# EAGLE schematic EuroKastle_PCB_SCHEM (EAGLE 9.0.0)
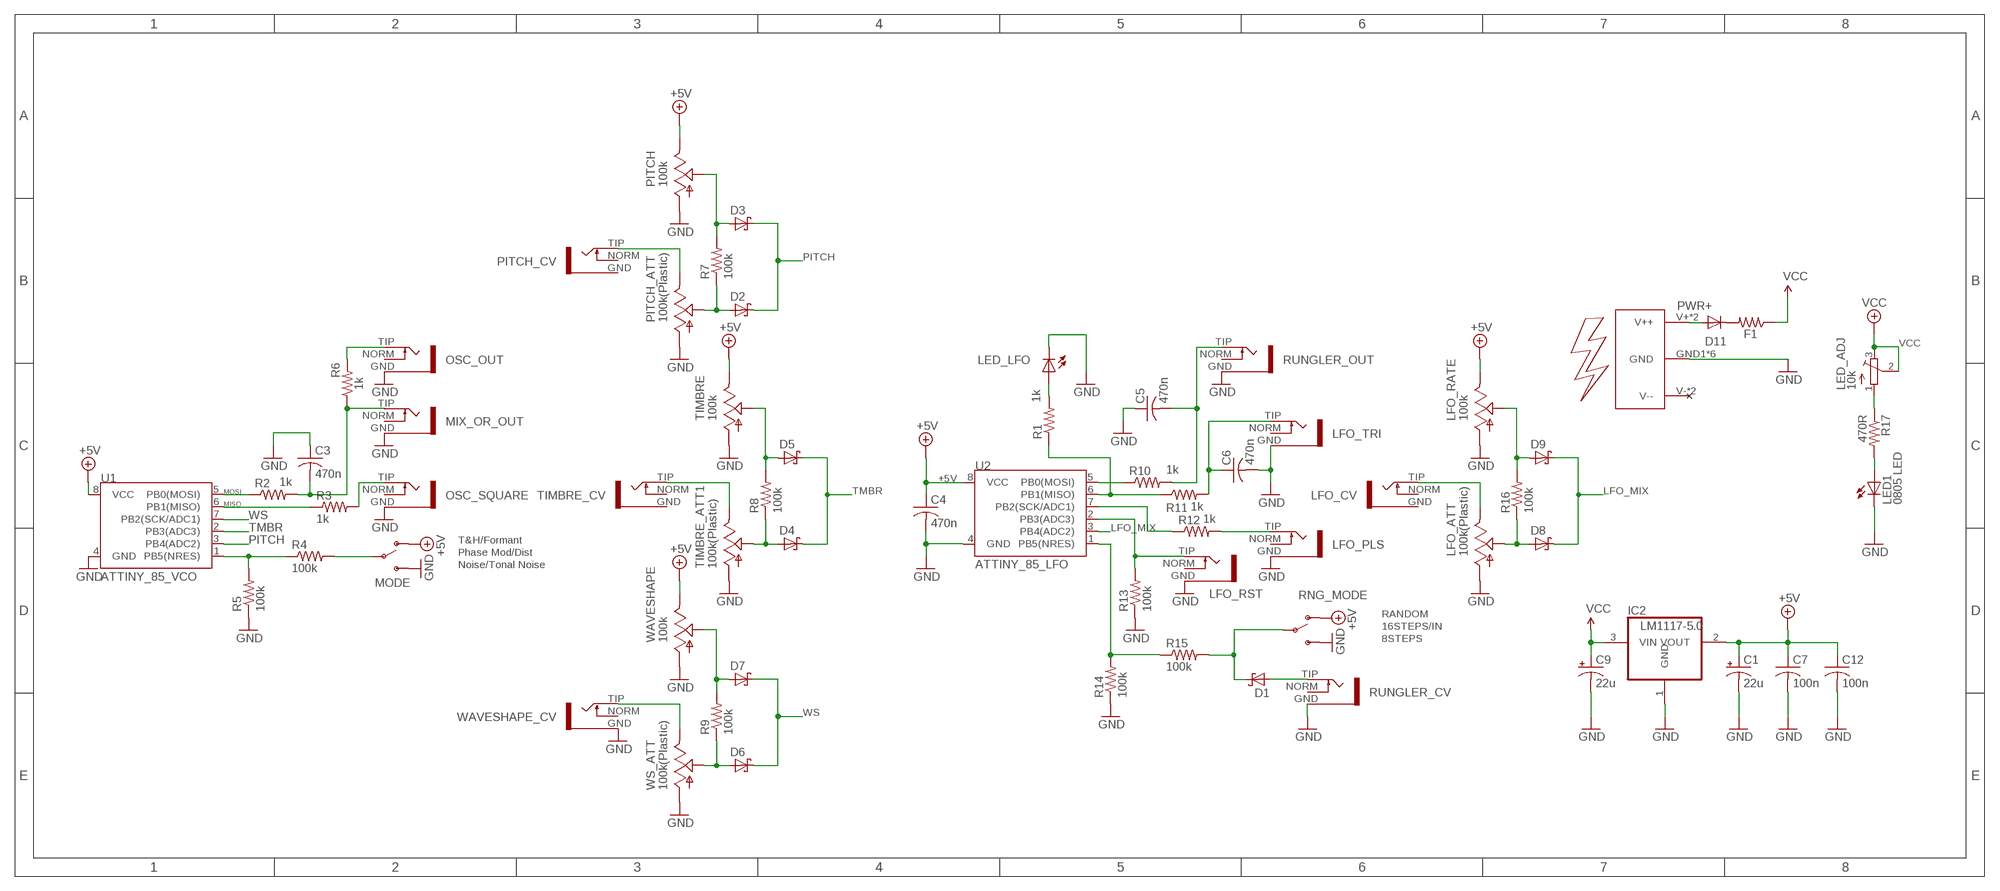
[diagram p0: schematic, sheet 1]

## Parts
C1  22u  CPOL-USE2.5-6  [E2,5-6]
C3  470n  C-USC0603  [C0603]
C4  470n  C-USC0603  [C0603]
C5  470n  C-USC0603  [C0603]
C6  470n  C-USC0603  [C0603]
C7  100n  C-USC0603  [C0603]
C9  22u  CPOL-USE2.5-6  [E2,5-6]
C12  100n  C-USC0603  [C0603]
D1  610-CMDZ5L1  PMEG4005AEA  [SOD323(F)]
D2  610-CMDZ5L1  PMEG4005AEA  [SOD323(F)]
D3  610-CMDZ5L1  PMEG4005AEA  [SOD323(F)]
D4  610-CMDZ5L1  PMEG4005AEA  [SOD323(F)]
D5  610-CMDZ5L1  PMEG4005AEA  [SOD323(F)]
D6  610-CMDZ5L1  PMEG4005AEA  [SOD323(F)]
D7  610-CMDZ5L1  PMEG4005AEA  [SOD323(F)]
D8  610-CMDZ5L1  PMEG4005AEA  [SOD323(F)]
D9  610-CMDZ5L1  PMEG4005AEA  [SOD323(F)]
D11  1N5819HW  DIODE-SOD123  [SOD123]
F1  100Ohms  R-US_R0603  [R0603]
IC2  LM1117-5.0  REG1117  [SOT223]
LED1  0805 LED  LEDCHIP-LED0805  [CHIP-LED0805]
LED_ADJ  10k  TRIMPOTTC33X  [TC33X]
LED_LFO  LED3MM  [LED3MM]
LFO_ATT  100k(Plastic)  9MM_SNAP-IN_POT_  [9MM_SNAP-IN_POT]
LFO_CV  INSTRUO_S_JACK_SMALL2  [INSTRUO_S_JACK_SMALL2]
LFO_PLS  INSTRUO_S_JACK_SMALL2  [INSTRUO_S_JACK_SMALL2]
LFO_RATE  100k  9MM_SNAP-IN_POT_  [9MM_SNAP-IN_POT]
LFO_RST  INSTRUO_S_JACK_SMALL2  [INSTRUO_S_JACK_SMALL2]
LFO_TRI  INSTRUO_S_JACK_SMALL2  [INSTRUO_S_JACK_SMALL2]
MIX_OR_OUT  INSTRUO_S_JACK_SMALL2  [INSTRUO_S_JACK_SMALL2]
MODE  SPDT_ON_OFF_ON_SUBMINI  SUBMINI_SPDT  [SUBMINI_TOGGLE]
OSC_OUT  INSTRUO_S_JACK_SMALL2  [INSTRUO_S_JACK_SMALL2]
OSC_SQUARE  INSTRUO_S_JACK_SMALL2  [INSTRUO_S_JACK_SMALL2]
PITCH  100k  9MM_SNAP-IN_POT_  [9MM_SNAP-IN_POT]
PITCH_ATT  100k(Plastic)  9MM_SNAP-IN_POT_  [9MM_SNAP-IN_POT]
PITCH_CV  INSTRUO_S_JACK_SMALL2  [INSTRUO_S_JACK_SMALL2]
POWER  EURO_POWER2  [EURO_POWER2]
R1  1k  R-US_R0603  [R0603]
R2  1k  R-US_R0603  [R0603]
R3  1k  R-US_R0603  [R0603]
R4  100k  R-US_R0603  [R0603]
R5  100k  R-US_R0603  [R0603]
R6  1k  R-US_R0603  [R0603]
R7  100k  R-US_R0603  [R0603]
R8  100k  R-US_R0603  [R0603]
R9  100k  R-US_R0603  [R0603]
R10  1k  R-US_R0603  [R0603]
R11  1k  R-US_R0603  [R0603]
R12  1k  R-US_R0603  [R0603]
R13  100k  R-US_R0603  [R0603]
R14  100k  R-US_R0603  [R0603]
R15  100k  R-US_R0603  [R0603]
R16  100k  R-US_R0603  [R0603]
R17  470R  R-US_R0603  [R0603]
RNG_MODE  SPDT_ON_OFF_ON_SUBMINI  SUBMINI_SPDT  [SUBMINI_TOGGLE]
RUNGLER_CV  INSTRUO_S_JACK_SMALL2  [INSTRUO_S_JACK_SMALL2]
RUNGLER_OUT  INSTRUO_S_JACK_SMALL2  [INSTRUO_S_JACK_SMALL2]
TIMBRE  100k  9MM_SNAP-IN_POT_  [9MM_SNAP-IN_POT]
TIMBRE_ATT1  100k(Plastic)  9MM_SNAP-IN_POT_  [9MM_SNAP-IN_POT]
TIMBRE_CV  INSTRUO_S_JACK_SMALL2  [INSTRUO_S_JACK_SMALL2]
U1  ATTINY_85_VCO  ATTINY45TINY45-20-DIP  [DIP08_MCU]
U2  ATTINY_85_LFO  ATTINY45TINY45-20-DIP  [DIP08_MCU]
WAVESHAPE  100k  9MM_SNAP-IN_POT_  [9MM_SNAP-IN_POT]
WAVESHAPE_CV  INSTRUO_S_JACK_SMALL2  [INSTRUO_S_JACK_SMALL2]
WS_ATT  100k(Plastic)  9MM_SNAP-IN_POT_  [9MM_SNAP-IN_POT]

## Nets
+5V [+5V]: C1.+ C4.1 C7.1 C12.1 IC2.2(VOUT) LFO_RATE.3(E) MODE.1(O) PITCH.3(E) RNG_MODE.1(O) TIMBRE.3(E) U1.8(VCC) U2.8(VCC) WAVESHAPE.3(E)
GND [GND]: C1.- C3.1 C4.2 C5.1 C6.2 C7.2 C9.- C12.2 IC2.1(GND) LED1.C LED_LFO.K(C) LFO_ATT.1(A) LFO_PLS.GND LFO_RATE.1(A) LFO_RST.GND LFO_TRI.GND MIX_OR_OUT.GND MODE.3(S) OSC_OUT.GND OSC_SQUARE.GND PITCH.1(A) PITCH_ATT.1(A) POWER.GND1(GND) POWER.GND2(GND) POWER.GND3(GND) POWER.GND4(GND) POWER.GND5(GND) POWER.GND6(GND) R5.1 R13.1 R14.1 RNG_MODE.3(S) RUNGLER_CV.GND RUNGLER_OUT.GND TIMBRE.1(A) TIMBRE_ATT1.1(A) U1.4(GND) U2.4(GND) WAVESHAPE.1(A) WAVESHAPE_CV.GND WS_ATT.1(A)
LFO_MIX: D8.1(K) D9.1(K) U2.3(PB4(ADC2))
MISO: R3.1 U1.6(PB1(MISO))
MOSI: R2.1 U1.5(PB0(MOSI))
N$1: C3.2 MIX_OR_OUT.TIP R2.2 R6.1
N$2: R4.1 R5.2 U1.1(PB5(NRES))
N$3: OSC_SQUARE.TIP R3.2
N$4: MODE.COM(COMMON) R4.2
N$5: OSC_OUT.TIP R6.2
N$6: PITCH_ATT.3(E) PITCH_CV.TIP
N$7: D2.2(A) PITCH_ATT.2(S) R7.1
N$8: TIMBRE_ATT1.3(E) TIMBRE_CV.TIP
N$9: D3.2(A) PITCH.2(S) R7.2
N$10: D4.2(A) R8.1 TIMBRE_ATT1.2(S)
N$11: D5.2(A) R8.2 TIMBRE.2(S)
N$12: D6.2(A) R9.1 WS_ATT.2(S)
N$13: WAVESHAPE_CV.TIP WS_ATT.3(E)
N$14: D7.2(A) R9.2 WAVESHAPE.2(S)
N$15: R10.1 U2.5(PB0(MOSI))
N$16: C5.2 R10.2 RUNGLER_OUT.TIP
N$17: R1.1 R11.1 U2.6(PB1(MISO))
N$18: C6.1 LFO_TRI.TIP R11.2
N$19: LFO_RST.TIP R13.2 U2.2(PB3(ADC3))
N$20: R12.1 U2.7(PB2(SCK/ADC1))
N$21: LFO_PLS.TIP R12.2
N$22: R14.2 R15.1 U2.1(PB5(NRES))
N$23: LFO_ATT.3(E) LFO_CV.TIP
N$24: D1.2(A) RUNGLER_CV.TIP
N$25: D8.2(A) LFO_ATT.2(S) R16.1
N$26: D9.2(A) LFO_RATE.2(S) R16.2
N$27: D1.1(K) R15.2 RNG_MODE.COM(COMMON)
N$28: LED_LFO.A R1.2
N$29: LED1.A R17.2
N$30: LED_ADJ.1(A) R17.1
N$34 [+12V]: D11.C F1.2
PITCH: D2.1(K) D3.1(K) U1.3(PB4(ADC2))
PWR+ [+12V]: D11.A POWER.V+(V++) POWER.V++
TMBR: D4.1(K) D5.1(K) U1.2(PB3(ADC3))
VCC [+12V]: C9.+ F1.1 IC2.3(VIN) LED_ADJ.2(S) LED_ADJ.3(E)
WS: D6.1(K) D7.1(K) U1.7(PB2(SCK/ADC1))
Unconnected: LFO_CV.GND LFO_CV.NORM LFO_PLS.NORM LFO_RST.NORM LFO_TRI.NORM MIX_OR_OUT.NORM OSC_OUT.NORM OSC_SQUARE.NORM PITCH_CV.GND PITCH_CV.NORM POWER.V-(V--) POWER.V-- RUNGLER_CV.NORM RUNGLER_OUT.NORM TIMBRE_CV.GND TIMBRE_CV.NORM WAVESHAPE_CV.NORM

## Notes on the sheet
- T&H/Formant
- Phase Mod/Dist
- Noise/Tonal Noise
- RANDOM
- 16STEPS/IN
- 8STEPS

## Library data of the parts
C1 C9 = AA_Stobbert:CPOL-US: POLARIZED CAPACITOR, American symbol
C3-C6 = AA_Stobbert:C-US: CAPACITOR, American symbol
C7 C12 = rcl:C-US: CAPACITOR, American symbol
D1-D9 = nxp_60_1_1:PMEG4005: 40 V 0.5 A Very low VF MEGA Schottky barrier rectifier Planar Maximum Efficiency General Application (MEGA) Schottky barrier rectifier with an integrated guard ring for stress protection, encapsulated in a SOD323 (SC-76) very small SMD plastic packag AAL Eindhoven MK
D11 = diode:DIODE-: DIODE
F1 R1-R16 = AA_Stobbert:R-US_: RESISTOR, American symbol
IC2 = og-vreg:REG1117: 800mA and 1A Low Dropout (LDO) Positive Regulator 1.8V, 2.5V, 2.85V, 3.3V, 5V, and Adj
LED1 = adafruit:LED: LED OSRAM: - CHIPLED LG R971, LG N971, LY N971, LG Q971, LY Q971, LO R971, LY R971 LH N974, LH R974 LS Q976, LO Q976, LY Q976 LO Q996 - Hyper CHIPLED LW Q18S LB Q993, LB Q99A, LB R99A - SideLED LS A670, LO A670, LY A670, LG A670, LP A670 LB A673, LV A673, LT A673, LW A673 LH A674 LY A675 LS A676, LA A676, LO A676, LY A676, LW A676 LS A679, LY A679, LG A679 - Hyper Micro SIDELED® LS Y876, LA Y876, LO Y876, LY Y876 LT Y87S - SmartLED LW L88C, LW L88S LB L89C, LB L89S, LG L890 LS L89K, LO L89K, LY L89K LS L896, LA L896, LO L896, LY L896 - TOPLED LS T670, LO T670, LY T670, LG T670, LP T670 LSG T670, LSP T670, LSY T670, LOP T670, LYG T670 LG T671, LOG T671, LSG T671 LB T673, LV T673, LT T673, LW T673 LH T674 LS T676, LA T676, LO T676, LY T676, LB T676, LH T676, LSB T676, LW T676 LB T67C, LV T67C, LT T67C, LS T67K, LO T67K, LY T67K, LW E67C LS E67B, LA E67B, LO E67B, LY E67B, LB E67C, LV E67C, LT E67C LW T67C LS T679, LY T679, LG T679 LS T770, LO T770, LY T770, LG T770, LP T770 LB T773, LV T773, LT T773, LW T773 LH T774 LS E675, LA E675, LY E675, LS T675 LS T776, LA T776, LO T776, LY T776, LB T776 LHGB T686 LT T68C, LB T68C - Hyper Mini TOPLED® LB M676 - Mini TOPLED Santana® LG M470 LS M47K, LO M47K, LY M47K Source: http://www.osram.convergy.de/
LED_ADJ = adafruit:TRIMPOT: SMT trimmer potentiometer part number TC33X http://www.ladyada.net/library/eagle
LED_LFO = zlob:LED
LFO_ATT LFO_RATE PITCH PITCH_ATT TIMBRE TIMBRE_ATT1 WAVESHAPE WS_ATT = AA_Stobbert:9MM_SNAP-IN_POT: 9mm vertical snap-in pot, Alpha / Panasonic style
LFO_CV LFO_PLS LFO_RST LFO_TRI MIX_OR_OUT OSC_OUT OSC_SQUARE PITCH_CV RUNGLER_CV RUNGLER_OUT TIMBRE_CV WAVESHAPE_CV = AA_Stobbert:INSTRUO_S_JACK_SMALL2
MODE RNG_MODE = AA_Stobbert:SUBMINI_SPDT
POWER = INSTRUO:EURO_POWER2
R17 = adafruit:R-US_: RESISTOR, American symbol
U1 U2 = SparkFun-Retired:ATTINY45: Atmel 8-pin 2/4/8kB flash uC Retired; PROD_ID: IC-09439; VALUE: TINY45-20-DIP

## Net classes
0 default: width 0.254 mm
1 +12V: width 0.33 mm
2 +5V: width 0.33 mm
3 GND: width 0.33 mm